# EAGLE design 10chreceiver (EAGLE 9.6.2)
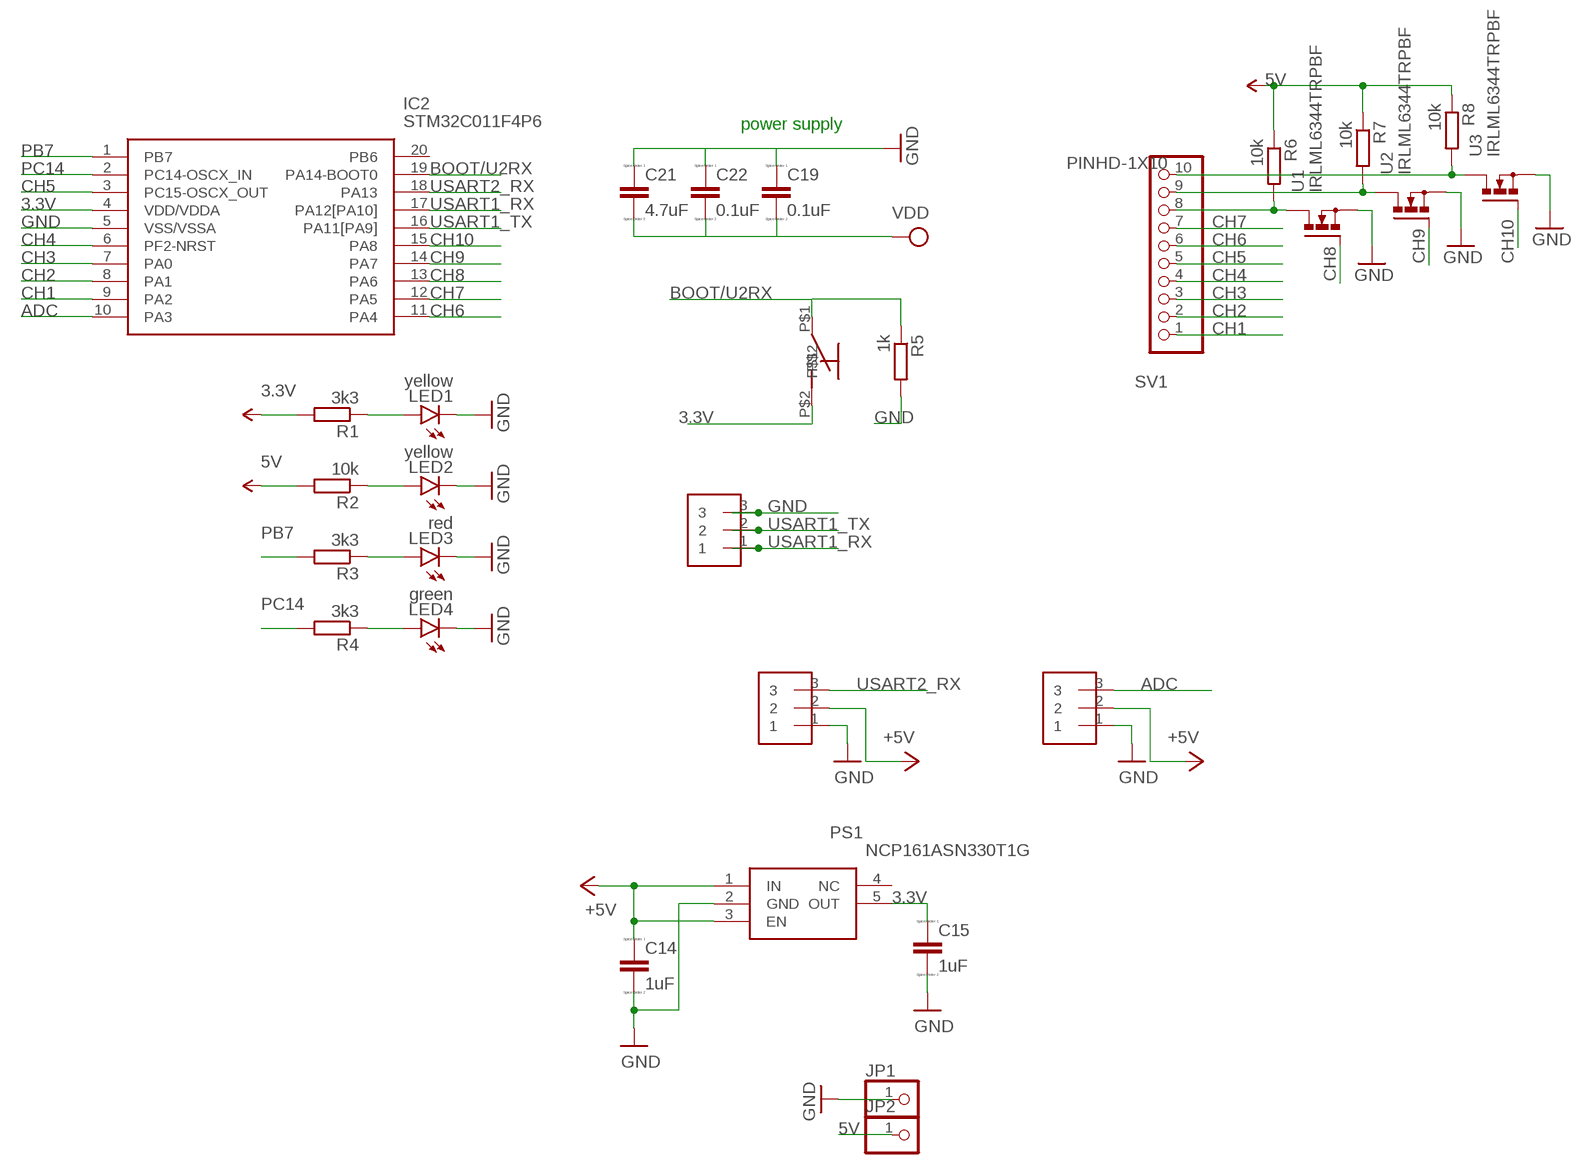
[diagram p0: schematic, sheet 1]

## Parts
C14  1uF  CC1608  [C1608]
C15  1uF  CC1608  [C1608]
C19  0.1uF  CC1608  [C1608]
C21  4.7uF  CC1608  [C1608]
C22  0.1uF  CC1608  [C1608]
CN1  1X3  [1X3]
CN2  1X3  [1X3]
CN3  1X3  [1X3]
IC2  STM32C011F4P6  [SOP65P640X120-20N]
JP1  PINHD-1X1  [1X01]
JP2  PINHD-1X1  [1X01]
LED1  yellow  LEDCHIPLED_0603  [CHIPLED_0603]
LED2  yellow  LEDCHIPLED_0603  [CHIPLED_0603]
LED3  red  LEDCHIPLED_0603  [CHIPLED_0603]
LED4  green  LEDCHIPLED_0603  [CHIPLED_0603]
PS1  NCP161ASN330T1G  [SOT95P280X145-5N]
R1  3k3  R-EU_R0603  [R0603]
R2  10k  R-EU_R0603  [R0603]
R3  3k3  R-EU_R0603  [R0603]
R4  3k3  R-EU_R0603  [R0603]
R5  1k  R-EU_R0603  [R0603]
R6  10k  R-EU_R0603  [R0603]
R7  10k  R-EU_R0603  [R0603]
R8  10k  R-EU_R0603  [R0603]
SV1  PINHD-1X10  [1X10-BIG]
SW2  TSY3420-TACTSW  [TSY3420-TACTSW]
U1  IRLML6344TRPBF  [SOT95P240X112-3N]
U2  IRLML6344TRPBF  [SOT95P240X112-3N]
U3  IRLML6344TRPBF  [SOT95P240X112-3N]

## Nets
3.3V: C15.1 C19.2 C21.2 C22.2 IC2.4(VDD/VDDA) PS1.5(OUT) R1.2 SW2.P$2 ; supply symbol labelled VDD, VCC
5V: C14.1 CN2.2 CN3.2 JP2.1 PS1.1(IN) PS1.3(EN) R2.2 R6.1 R7.1 R8.1 ; supply symbol labelled +5V, VCC
ADC: CN2.3 IC2.10(PA3)
BOOT/U2RX: IC2.19(PA14-BOOT0) R5.1 SW2.P$1
CH1: IC2.9(PA2) SV1.1
CH2: IC2.8(PA1) SV1.2
CH3: IC2.7(PA0) SV1.3
CH4: IC2.6(PF2-NRST) SV1.4
CH5: IC2.3(PC15-OSCX_OUT) SV1.5
CH6: IC2.11(PA4) SV1.6
CH7: IC2.12(PA5) SV1.7
CH8: IC2.13(PA6) U1.1(G)
CH9: IC2.14(PA7) U2.1(G)
CH10: IC2.15(PA8) U3.1(G)
GND: C14.2 C15.2 C19.1 C21.1 C22.1 CN1.3 CN2.1 CN3.1 IC2.5(VSS/VSSA) JP1.1 LED1.C LED2.C LED3.C LED4.C PS1.2(GND) R5.2 U1.2(S) U2.2(S) U3.2(S)
N$2: LED3.A R3.1
N$3: LED4.A R4.1
N$4: R6.2 SV1.8 U1.3(D)
N$5: LED1.A R1.1
N$10: R7.2 SV1.9 U2.3(D)
N$12: R8.2 SV1.10 U3.3(D)
N$15: LED2.A R2.1
PB7: IC2.1(PB7) R3.2
PC14: IC2.2(PC14-OSCX_IN) R4.2
USART1_RX: CN1.1 IC2.17(PA12[PA10])
USART1_TX: CN1.2 IC2.16(PA11[PA9])
USART2_RX: CN3.3 IC2.18(PA13)
Unconnected: IC2.20(PB6) PS1.4(NC)

## Notes on the sheet
- power supply

## Library data of the parts
C14 C15 C19 C21 C22 = eagle-ltspice:C: CAPACITOR, European symbol; SPICEMODEL: NONE; SPICEPREFIX: C
CN1-CN3 = SVD:1X3
IC2 = SamacSys_Parts:STM32C011F4P6: ARM Cortex-M0+ STM32L0 Microcontroller IC 32-Bit Single-Core 32MHz 16KB (16K x 8) FLASH 20-TSSOP Source: Datasheet <https://www.st.com/resource/en/datasheet/stm32c011d6.pdf>; DESCRIPTION: ARM Cortex-M0+ STM32L0 Microcontroller IC 32-Bit Single-Core 32MHz 16KB (16K x 8) FLASH 20-TSSOP; HEIGHT: 1.2mm; MANUFACTURER_NAME: STMicroelectronics; MANUFACTURER_PART_NUMBER: STM32C011F4P6; MOUSER_PART_NUMBER: 511-STM32C011F4P6; MOUSER_PRICE-STOCK: https://www.mouser.co.uk/ProductDetail/STMicroelectronics/STM32C011F4P6?qs=IPgv5n7u5Qbo1GzhbgPEPw%3D%3D
JP1 JP2 = pinhead:PINHD-1X1: PIN HEADER
LED1-LED4 = led:LED: LED OSRAM: - CHIPLED LG R971, LG N971, LY N971, LG Q971, LY Q971, LO R971, LY R971 LH N974, LH R974 LS Q976, LO Q976, LY Q976 LO Q996 - Hyper CHIPLED LW Q18S LB Q993, LB Q99A, LB R99A - SideLED LS A670, LO A670, LY A670, LG A670, LP A670 LB A673, LV A673, LT A673, LW A673 LH A674 LY A675 LS A676, LA A676, LO A676, LY A676, LW A676 LS A679, LY A679, LG A679 - Hyper Micro SIDELED® LS Y876, LA Y876, LO Y876, LY Y876 LT Y87S - SmartLED LW L88C, LW L88S LB L89C, LB L89S, LG L890 LS L89K, LO L89K, LY L89K LS L896, LA L896, LO L896, LY L896 - TOPLED LS T670, LO T670, LY T670, LG T670, LP T670 LSG T670, LSP T670, LSY T670, LOP T670, LYG T670 LG T671, LOG T671, LSG T671 LB T673, LV T673, LT T673, LW T673 LH T674 LS T676, LA T676, LO T676, LY T676, LB T676, LH T676, LSB T676, LW T676 LB T67C, LV T67C, LT T67C, LS T67K, LO T67K, LY T67K, LW E67C LS E67B, LA E67B, LO E67B, LY E67B, LB E67C, LV E67C, LT E67C LW T67C LS T679, LY T679, LG T679 LS T770, LO T770, LY T770, LG T770, LP T770 LB T773, LV T773, LT T773, LW T773 LH T774 LS E675, LA E675, LY E675, LS T675 LS T776, LA T776, LO T776, LY T776, LB T776 LHGB T686 LT T68C, LB T68C - Hyper Mini TOPLED® LB M676 - Mini TOPLED Santana® LG M470 LS M47K, LO M47K, LY M47K Source: http://www.osram.convergy.de LUXEON: - LUMILED® LXK2-PW12-R00, LXK2-PW12-S00, LXK2-PW14-U00, LXK2-PW14-V00 LXK2-PM12-R00, LXK2-PM12-S00, LXK2-PM14-U00 LXK2-PE12-Q00, LXK2-PE12-R00, LXK2-PE12-S00, LXK2-PE14-T00, LXK2-PE14-U00 LXK2-PB12-K00, LXK2-PB12-L00, LXK2-PB12-M00, LXK2-PB14-N00, LXK2-PB14-P00, LXK2-PB14-Q00 LXK2-PR12-L00, LXK2-PR12-M00, LXK2-PR14-Q00, LXK2-PR14-R00 LXK2-PD12-Q00, LXK2-PD12-R00, LXK2-PD12-S00 LXK2-PH12-R00, LXK2-PH12-S00 LXK2-PL12-P00, LXK2-PL12-Q00, LXK2-PL12-R00 Source: www.luxeon.com KINGBRIGHT: KA-3528ASYC Source: www.kingbright.com
PS1 = SamacSys_Parts:NCP161ASN330T1G: ON SEMICONDUCTOR - NCP161ASN330T1G - Fixed LDO Voltage Regulator, 1.9V to 5.5V, 225mV drop, 3.3V/450mA out, SOT-23-5 Source: Datasheet <https://componentsearchengine.com/Datasheets/2/NCP161ASN330T1G.pdf>; ARROW_PART_NUMBER: NCP161ASN330T1G; ARROW_PRICE-STOCK: https://www.arrow.com/en/products/ncp161asn330t1g/on-semiconductor?region=nac; DESCRIPTION: ON SEMICONDUCTOR - NCP161ASN330T1G - Fixed LDO Voltage Regulator, 1.9V to 5.5V, 225mV drop, 3.3V/450mA out, SOT-23-5; HEIGHT: 1.45mm; MANUFACTURER_NAME: onsemi; MANUFACTURER_PART_NUMBER: NCP161ASN330T1G; MOUSER_PART_NUMBER: 863-NCP161ASN330T1G; MOUSER_PRICE-STOCK: https://www.mouser.co.uk/ProductDetail/onsemi/NCP161ASN330T1G?qs=vLWxofP3U2ze5zA%252BHmAd3w%3D%3D
R1-R8 = rcl:R-EU_: RESISTOR, European symbol; SPICEPREFIX: R
SV1 = adafruit:PINHD-1X10: Pin header 1x10 0.1" spacing With round pins
SW2 = SVD:TSY3420-TACTSW
U1-U3 = IRLML6344TRPBF:IRLML6344TRPBF: IRLML6344TRPBF; MPN: IRLML6344TRPBF; OC_FARNELL: 1857299; OC_NEWARK: 25T5501; PACKAGE: SOT-23-3; SUPPLIER: INTERNATIONAL RECTIFIER

## Board
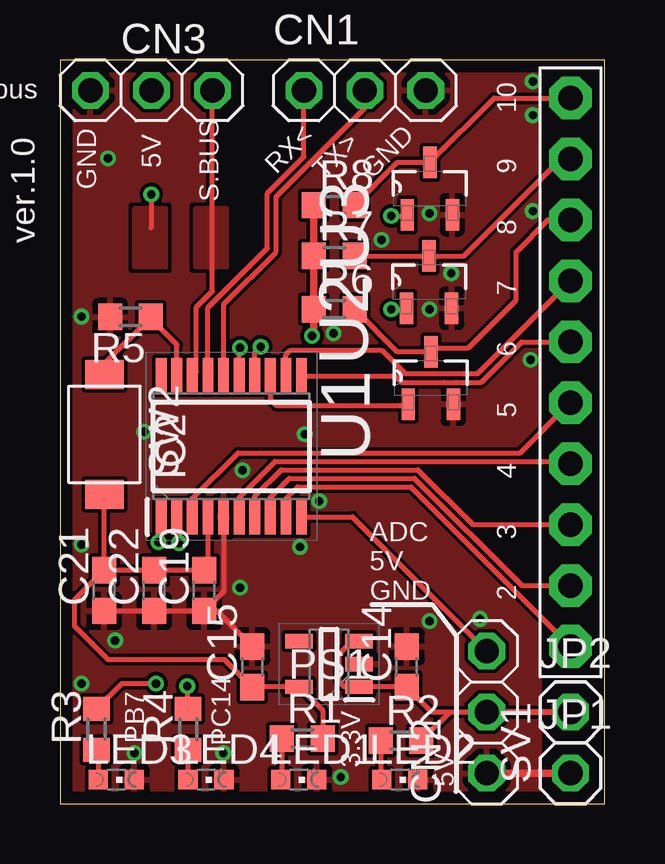
[diagram p1: board, top side]
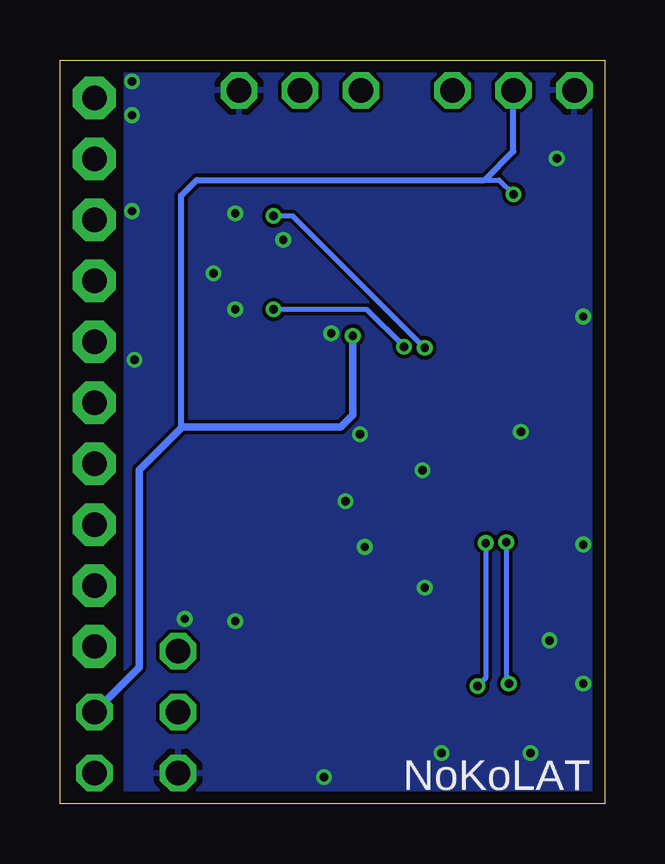
[diagram p2: board, bottom side, seen from below]

Size 22.7 x 31 mm. Coordinates in mm from the lower left corner, seen from the top.
Outline: 0,0 22.7,0 22.7,31 0,31 0,0
Copper layers (1*16): Top 0.035mm / dielectric 1.6mm / Bottom 0.035mm
Design rules "Elecrow_2-layer_PCB_eagle_rule": minimum track width 6mil, minimum drill 12mil, track to track 6mil, track to pad 6mil, pad to pad 6mil, via to via 8mil, smd to smd 0mil, copper to edge 20mil, drill to drill 10mil, minimum pad ring 6mil, minimum via ring 6mil, stop-mask expansion 0mil, vias tented up to drill 100mil, thermal gap 10mil

### Footprints (pad centres in the part's own frame; a part is rotated, then mirrored left to right if it is on the bottom)
C1608 = smd 1.1 x 1: 1 -0.85,0; 2 0.85,0
1X3 = drill 1.016 octagon: 1 -2.54,0; 2 0,0; 3 2.54,0
SOP65P640X120-20N = smd 1.475 x 0.45: 1 -2.938,2.925; 2 -2.938,2.275; 3 -2.938,1.625; 4 -2.938,0.975; 5 -2.938,0.325; 6 -2.938,-0.325; 7 -2.938,-0.975; 8 -2.938,-1.625; 9 -2.938,-2.275; 10 -2.938,-2.925; 11 2.938,-2.925; 12 2.938,-2.275; 13 2.938,-1.625; 14 2.938,-0.975; 15 2.938,-0.325; 16 2.938,0.325; 17 2.938,0.975; 18 2.938,1.625; 19 2.938,2.275; 20 2.938,2.925
1X01 = drill 1.016 octagon: 1 0,0
CHIPLED_0603 = smd 0.8 x 0.8: A 0,-0.75; C 0,0.75
SOT95P280X145-5N = smd 1.15 x 0.6: 1 -1.25,0.95; 2 -1.25,0; 3 -1.25,-0.95; 4 1.25,-0.95; 5 1.25,0.95
R0603 = smd 1 x 1.1: 1 -0.85,0; 2 0.85,0
1X10-BIG = drill 1.016 pad 1.778 octagon: 1 -11.43,0; 2 -8.89,0; 3 -6.35,0; 4 -3.81,0; 5 -1.27,0; 6 1.27,0; 7 3.81,0; 8 6.35,0; 9 8.89,0; 10 11.43,0
TSY3420-TACTSW = smd 1.2 x 1.6: P$1 2.5,0; P$2 -2.5,0
SOT95P240X112-3N = smd 1.321 x 0.559: 1 -1.092,0.94; 2 -1.092,-0.94; 3 1.092,0

### Placement (x,y rotation side)
C14  14.45,5.7 90 top
C15  8.02,5.7 90 top
C19  6.01,8.88 90 top
C21  1.84,8.88 90 top
C22  3.92,8.88 90 top
CN1  12.7,29.73 0 top
CN2  17.78,3.81 90 top
CN3  3.81,29.73 0 top
IC2  7.14,14.89 90 top
JP1  21.27,1.27 0 top
JP2  21.27,3.81 0 top
LED1  9.95,1 270 top
LED2  14.16,1 270 top
LED3  2.34,1 270 top
LED4  6.08,1 270 top
PS1  11.21,5.82 180 top
R1  10.09,2.71 0 top
R2  14.21,2.63 0 top
R3  1.52,3.1 90 top
R4  5.34,3.09 90 top
R5  2.94,20.29 180 top
R6  11.43,20.61 0 top
R7  11.43,22.83 0 top
R8  11.43,24.95 0 top
SV1  21.27,17.98 90 top
SW2  1.85,15.39 90 top
U1  15.45,17.74 90 top
U2  15.38,21.74 90 top
U3  15.41,25.64 90 top

### Tracks (layer width: path | path; a pad name or v marks a point on that pad's centre or on a via)
3.3V
  Top 0.203: C21.2 0.61,8.5 0.61,7.39 2,6 6.87,6 C15.1 8.03,4.87 PS1.5 10.94,3.89 R1.2 | C21.2 1.84,12.88 SW2.P$2 | C21.2 C22.2 C19.2 6.17,9.88 IC2.4
5V  (via drill 0.35)
  Top 0.203: PS1.3 12.17,6.77 11.63,6.24 11.63,5.07 11.83,4.87 PS1.1 14.43,4.87 C14.1 15.49,3.81 16.24,3.81 | CN2.2 16.24,3.81 | R2.2 16.24,3.81 | R6.1 10.58,21 R7.1 | v3.8,25.4 3.8,24
  Top 0.254: JP2.1 CN2.2
  Top 0.305: v10.5,19.5 10.58,19.58 10.58,21 | R6.1 R7.1 R8.1
  Bottom 0.203: 5,26 4.4,26 v3.8,25.4
  Bottom 0.254: 17.65,15.65 17.65,25.35 17,26 5,26 3.81,27.19 CN3.2
  Bottom 0.305: v10.5,19.5 10.5,16.2 11,15.7 17.6,15.7 17.65,15.65 19.4,13.9 19.4,6 19.4,5.68 JP2.1
  pour Top: 4.41,22.38 4.41,24.8 3.1,24.8 3.1,22.38
ADC
  Top 0.203: IC2.10 12.18,11.95 CN2.3
BOOT/U2RX
  Top 0.203: SW2.P$1 1.85,18.35 3.75,20.25 | 3.75,20.25 R5.1 | IC2.19 4.87,19.13 3.75,20.25
CH1
  Top 0.203: IC2.9 9.42,12.72 9.9,13.2 14.62,13.2 SV1.1
CH2
  Top 0.203: IC2.8 8.77,12.77 9.56,13.56 14.77,13.56 19.23,9.09 SV1.2
CH3
  Top 0.203: IC2.7 8.12,12.82 9.21,13.91 14.91,13.91 17.2,11.63 SV1.3
CH4
  Top 0.203: IC2.6 7.47,12.77 8.97,14.27 21.17,14.27 SV1.4
CH5
  Top 0.203: IC2.3 5.52,12.72 7.42,14.62 19.18,14.62 SV1.5
CH6
  Top 0.203: IC2.11 13.97,17.83 14.24,17.56 16,17.56 16.5,17.56 17.55,17.56 19.23,19.25 SV1.6
CH7
  Top 0.203: IC2.12 9.42,18.72 9.6,18.9 13.4,18.9 14.38,17.92 17.4,17.92 SV1.7
CH8
  Top 0.203: IC2.13 8.77,16.83 9,16.6 14.46,16.6 U1.1
CH9  (via drill 0.35)
  Top 0.203: IC2.14 8.12,18.79 v8.37,19.04 | v13.8,20.6 14.39,20.6 U2.1
  Bottom 0.203: v8.37,19.04 9.92,20.6 v13.8,20.6
CH10  (via drill 0.35)
  Top 0.203: IC2.15 7.47,18.97 v7.5,19 | v13.8,24.5 14.42,24.5 U3.1
  Bottom 0.203: v7.5,19 13,24.5 v13.8,24.5
GND  (via drill 0.35)
  Top 0.203: IC2.5 6.82,8.84 C19.1 | C21.1 C22.1 C19.1 | C15.2 6.54,8.03 C19.1
  Top 0.305: CN2.1 JP1.1
  other vias: 10.8,12.6 10,10.7 17.5,7.7 15.4,7.6 19.7,24.7 19.7,30.1 19.7,28.7 13.4,23.5 15.4,24.6 15.4,20.6 16.3,22.1 11.4,19.6 7.5,9 0.9,10.8 2.3,6.8 0.9,5 3.1,2.1 6.8,2.1 11.7,1.1 19.6,18.5 10.2,15.4 3.5,15.5 7.6,13.9 0.9,20.3 2,26.9
  pour Bottom: -1.27,31.48 -1.27,0 19.99,0 19.99,31.48
  pour Top (rank 2): -2.54,31.48 -2.54,-1.27 20,-1.27 20,31.48
  pour Top: 1.87,22.38 1.87,24.8 0.56,24.8 0.56,22.38
  pour Top: 1.87,22.38 1.87,24.8 0.56,24.8 0.56,22.38
N$2
  Top 0.203: R3.1 1.59,2.18 LED3.A
N$3
  Top 0.203: R4.1 LED4.A
N$4
  Top 0.203: R6.2 14.06,18.83 U1.3 15.62,19 17,19 19,21 19,23 20.33,24.33 SV1.8
N$5
  Top 0.203: R1.1 9.24,1.04 LED1.A
N$10
  Top 0.203: R7.2 U2.3 16.83,22.83 20.87,26.87 SV1.9
N$12
  Top 0.203: R8.2 14.06,26.73 U3.3 18.09,29.41 SV1.10
N$15
  Top 0.203: R2.1 13.36,1.05 LED2.A
PB7  (via drill 0.35)
  Top 0.203: IC2.1 4.22,11.01 v4.1,10.9 | v4,5 2.57,5 R3.2
  Bottom 0.203: v4.1,10.9 4.1,5.1 v4,5
PC14  (via drill 0.35)
  Top 0.203: IC2.2 4.96,11.85 v4.96,10.86 | v5.3,4.9 5.3,3.98 R4.2
  Bottom 0.203: v4.96,10.86 4.96,5.24 v5.3,4.9
USART1_RX
  Top 0.203: IC2.17 6.17,20.67 8.64,23.15 8.64,25.45 10.16,26.96 CN1.1
USART1_TX
  Top 0.203: IC2.16 6.82,20.82 9,23 9,25.3 12.7,29 CN1.2
USART2_RX
  Top 0.203: IC2.18 5.69,18 5.69,20.69 6.35,21.36 CN3.3
  pour Top (isolate 0.254): 6.95,22.38 6.95,24.8 5.64,24.8 5.64,22.38

### Text on the board
tPlace: 10 | GND | 5V | RX< | TX> | GND | 9 | S.BUS | 8 | 7 | 6 | 5 | 4 | 3 | ADC / 5V / GND | 2 | PB7 | PC14 | 3.3V | 5V
bPlace: NoKoLAT
tNames: s.bus | 10ch recerver / ver.1.0